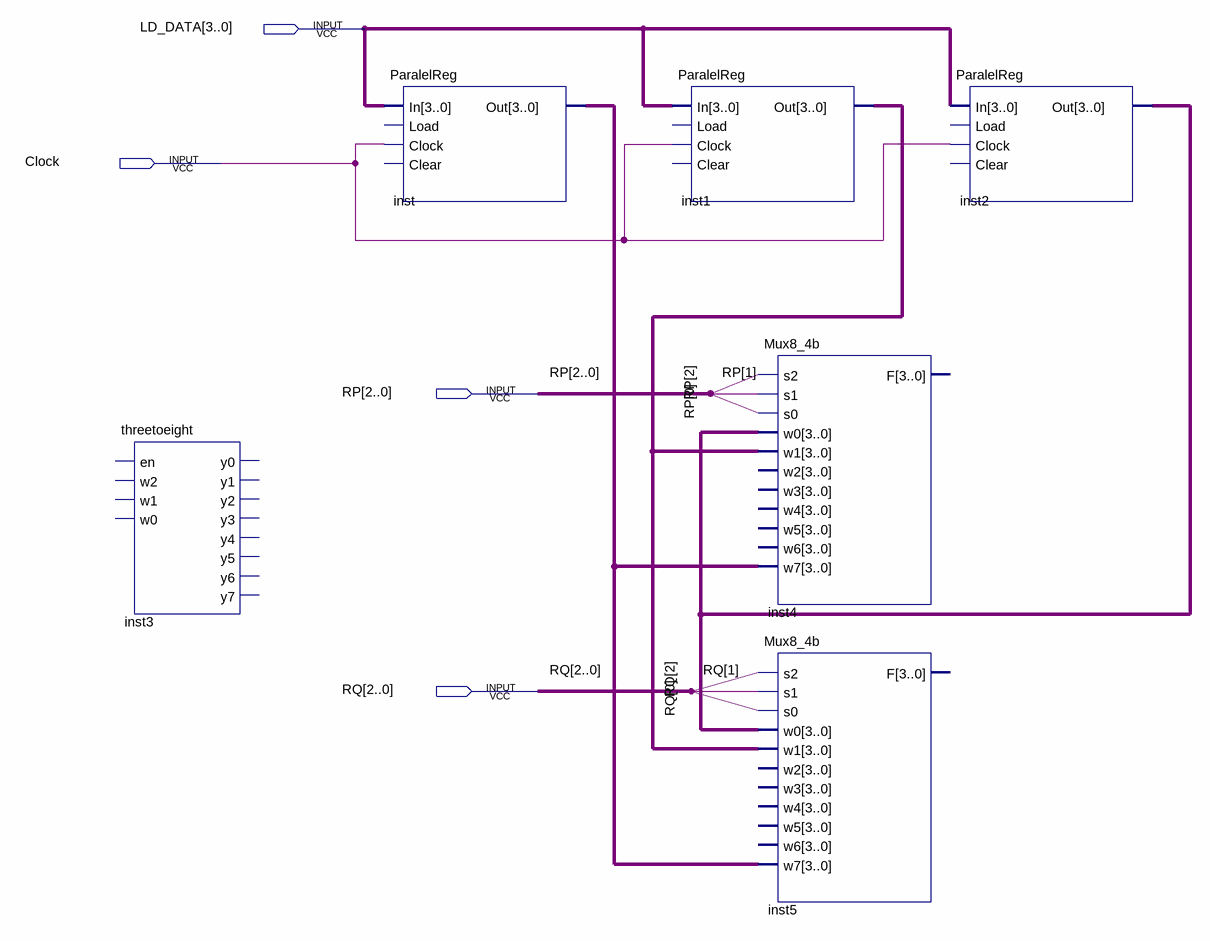
[diagram p0: schematic sheet]
// Quartus schematic mainreg.bdf as structural Verilog: 6 symbols, 4 pins
module mainreg (
  input  [3:0] LD_DATA,
  input  Clock,
  input  [2:0] RP,
  input  [2:0] RQ
);

  wire [3:0] inst1_out, inst2_out, inst_out;

  threetoeight inst3 ();  // open: en, w2, w1, w0, y0, y1, y2, y3, y4, y5, y6, y7
  ParalelReg inst (.In(LD_DATA), .Clock(Clock), .Out(inst_out));  // open: Load, Clear
  ParalelReg inst1 (.In(LD_DATA), .Clock(Clock), .Out(inst1_out));  // open: Load, Clear
  Mux8_4b inst4 (
    .s2(RP[2]), .s1(RP[1]), .s0(RP[0]), .w0(inst2_out), .w1(inst1_out), .w7(inst_out));  // open: w2, w3, w4, w5, w6, F
  Mux8_4b inst5 (
    .s2(RQ[2]), .s1(RQ[1]), .s0(RQ[0]), .w0(inst2_out), .w1(inst1_out), .w7(inst_out));  // open: w2, w3, w4, w5, w6, F
  ParalelReg inst2 (.In(LD_DATA), .Clock(Clock), .Out(inst2_out));  // open: Load, Clear
endmodule
